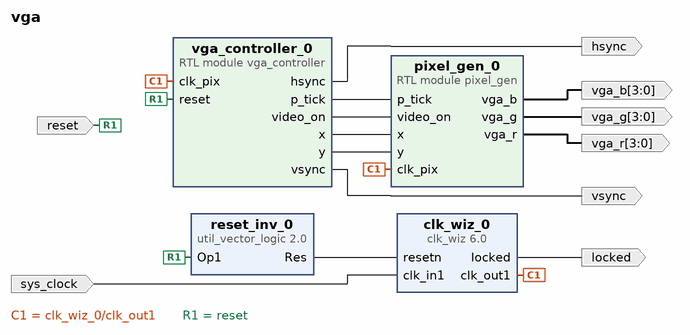
[diagram p0: block diagram of the top level]
# Vivado block design vga, xc7a35tcpg236-1, Vivado 2022.2
create_bd_design vga

create_bd_port -dir I -type clk sys_clock
set_property -dict {CONFIG.FREQ_HZ 100000000 CONFIG.PHASE 0.0} [get_bd_ports sys_clock]
create_bd_port -dir I -type rst reset
set_property -dict {CONFIG.POLARITY ACTIVE_HIGH} [get_bd_ports reset]
create_bd_port -dir O locked
create_bd_port -dir O vsync
create_bd_port -dir O hsync
create_bd_port -dir O -from 3 -to 0 vga_r
create_bd_port -dir O -from 3 -to 0 vga_g
create_bd_port -dir O -from 3 -to 0 vga_b

create_bd_cell -type ip -vlnv xilinx.com:ip:clk_wiz:6.0 clk_wiz_0
set_property -dict [list \
  CONFIG.CLKOUT1_JITTER 217.614 \
  CONFIG.CLKOUT1_PHASE_ERROR 245.344 \
  CONFIG.CLKOUT1_REQUESTED_OUT_FREQ 148.5 \
  CONFIG.CLK_IN1_BOARD_INTERFACE sys_clock \
  CONFIG.MMCM_CLKFBOUT_MULT_F 37.125 \
  CONFIG.MMCM_CLKOUT0_DIVIDE_F 6.250 \
  CONFIG.MMCM_DIVCLK_DIVIDE 4 \
  CONFIG.RESET_BOARD_INTERFACE reset \
  CONFIG.RESET_PORT resetn \
  CONFIG.RESET_TYPE ACTIVE_LOW \
  CONFIG.USE_BOARD_FLOW true \
] [get_bd_cells clk_wiz_0]
create_bd_cell -type ip -vlnv xilinx.com:ip:util_vector_logic:2.0 reset_inv_0
set_property -dict {CONFIG.C_OPERATION not CONFIG.C_SIZE 1} [get_bd_cells reset_inv_0]
create_bd_cell -type module -reference vga_controller vga_controller_0
create_bd_cell -type module -reference pixel_gen pixel_gen_0

# ---- connections ----

connect_bd_net [get_bd_pins clk_wiz_0/clk_out1] [get_bd_pins vga_controller_0/clk_pix] [get_bd_pins pixel_gen_0/clk_pix]
connect_bd_net [get_bd_pins clk_wiz_0/locked] [get_bd_ports locked]
connect_bd_net [get_bd_pins pixel_gen_0/vga_b] [get_bd_ports vga_b]
connect_bd_net [get_bd_pins pixel_gen_0/vga_g] [get_bd_ports vga_g]
connect_bd_net [get_bd_pins pixel_gen_0/vga_r] [get_bd_ports vga_r]
connect_bd_net [get_bd_ports reset] [get_bd_pins reset_inv_0/Op1] [get_bd_pins vga_controller_0/reset]
connect_bd_net [get_bd_pins reset_inv_0/Res] [get_bd_pins clk_wiz_0/resetn]
connect_bd_net [get_bd_ports sys_clock] [get_bd_pins clk_wiz_0/clk_in1]
connect_bd_net [get_bd_pins vga_controller_0/hsync] [get_bd_ports hsync]
connect_bd_net [get_bd_pins vga_controller_0/p_tick] [get_bd_pins pixel_gen_0/p_tick]
connect_bd_net [get_bd_pins vga_controller_0/video_on] [get_bd_pins pixel_gen_0/video_on]
connect_bd_net [get_bd_pins vga_controller_0/vsync] [get_bd_ports vsync]
connect_bd_net [get_bd_pins vga_controller_0/x] [get_bd_pins pixel_gen_0/x]
connect_bd_net [get_bd_pins vga_controller_0/y] [get_bd_pins pixel_gen_0/y]

validate_bd_design
save_bd_design
